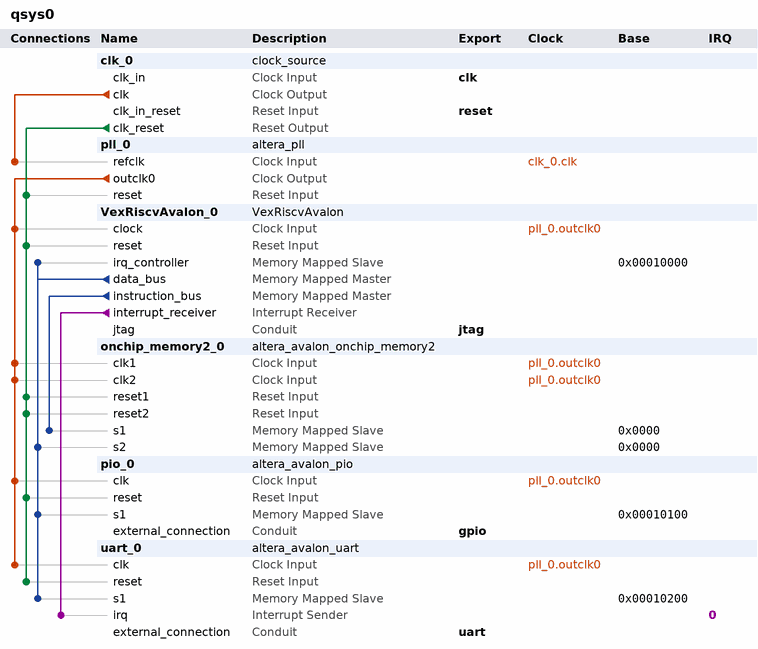
[diagram p0: system contents]
# Platform Designer (Qsys) system qsys0, Cyclone V 5CSEMA5F31C6
# Parameters at their usual value, and those the tool derives, are not listed.
package require -exact qsys 21.1
create_system qsys0
set_project_property DEVICE_FAMILY {Cyclone V}
set_project_property DEVICE 5CSEMA5F31C6

add_instance clk_0 clock_source 21.1
set_instance_parameter_value clk_0 clockFrequency 50000000

add_instance pll_0 altera_pll 21.1
set_instance_parameter_value pll_0 gui_device_speed_grade 2
set_instance_parameter_value pll_0 gui_number_of_clocks 1
set_instance_parameter_value pll_0 gui_operation_mode normal
set_instance_parameter_value pll_0 gui_output_clock_frequency0 25.0
set_instance_parameter_value pll_0 gui_pll_mode {Integer-N PLL}
set_instance_parameter_value pll_0 gui_reference_clock_frequency 50.0
set_instance_parameter_value pll_0 gui_use_locked false

add_instance VexRiscvAvalon_0 VexRiscvAvalon 1.0
set_instance_parameter_value VexRiscvAvalon_0 CORE_CONFIG 1
set_instance_parameter_value VexRiscvAvalon_0 C_EXCEPTION_VECTOR 32
set_instance_parameter_value VexRiscvAvalon_0 C_IO_BEGIN 65536
set_instance_parameter_value VexRiscvAvalon_0 C_IO_END 131071
set_instance_parameter_value VexRiscvAvalon_0 C_RESET_VECTOR 16

add_instance onchip_memory2_0 altera_avalon_onchip_memory2 21.1
set_instance_parameter_value onchip_memory2_0 dataWidth 32
set_instance_parameter_value onchip_memory2_0 dualPort true
set_instance_parameter_value onchip_memory2_0 initMemContent true
set_instance_parameter_value onchip_memory2_0 initializationFileName bootrom.mif
set_instance_parameter_value onchip_memory2_0 memorySize 32768
set_instance_parameter_value onchip_memory2_0 useNonDefaultInitFile true

add_instance pio_0 altera_avalon_pio 21.1
set_instance_parameter_value pio_0 bitModifyingOutReg true
set_instance_parameter_value pio_0 direction Bidir
set_instance_parameter_value pio_0 simDoTestBenchWiring true
set_instance_parameter_value pio_0 width 32

add_instance uart_0 altera_avalon_uart 21.1
set_instance_parameter_value uart_0 baud 115200
set_instance_parameter_value uart_0 dataBits 8
set_instance_parameter_value uart_0 fixedBaud true
set_instance_parameter_value uart_0 parity NONE
set_instance_parameter_value uart_0 stopBits 1

# connections
add_connection clk_0.clk pll_0.refclk clock
add_connection pll_0.outclk0 onchip_memory2_0.clk1 clock
add_connection pll_0.outclk0 onchip_memory2_0.clk2 clock
add_connection pll_0.outclk0 pio_0.clk clock
add_connection pll_0.outclk0 uart_0.clk clock
add_connection pll_0.outclk0 VexRiscvAvalon_0.clock clock
add_connection clk_0.clk_reset onchip_memory2_0.reset1 reset
add_connection clk_0.clk_reset onchip_memory2_0.reset2 reset
add_connection clk_0.clk_reset pio_0.reset reset
add_connection clk_0.clk_reset pll_0.reset reset
add_connection clk_0.clk_reset uart_0.reset reset
add_connection clk_0.clk_reset VexRiscvAvalon_0.reset reset
add_connection VexRiscvAvalon_0.data_bus onchip_memory2_0.s2 avalon
set_connection_parameter_value VexRiscvAvalon_0.data_bus/onchip_memory2_0.s2 baseAddress 0x0000
add_connection VexRiscvAvalon_0.data_bus pio_0.s1 avalon
set_connection_parameter_value VexRiscvAvalon_0.data_bus/pio_0.s1 baseAddress 0x00010100
add_connection VexRiscvAvalon_0.data_bus uart_0.s1 avalon
set_connection_parameter_value VexRiscvAvalon_0.data_bus/uart_0.s1 baseAddress 0x00010200
add_connection VexRiscvAvalon_0.data_bus VexRiscvAvalon_0.irq_controller avalon
set_connection_parameter_value VexRiscvAvalon_0.data_bus/VexRiscvAvalon_0.irq_controller baseAddress 0x00010000
add_connection VexRiscvAvalon_0.instruction_bus onchip_memory2_0.s1 avalon
set_connection_parameter_value VexRiscvAvalon_0.instruction_bus/onchip_memory2_0.s1 baseAddress 0x0000
add_connection VexRiscvAvalon_0.interrupt_receiver uart_0.irq interrupt
set_connection_parameter_value VexRiscvAvalon_0.interrupt_receiver/uart_0.irq irqNumber 0

# exported interfaces
add_interface clk clock sink
set_interface_property clk EXPORT_OF clk_0.clk_in
add_interface gpio conduit end
set_interface_property gpio EXPORT_OF pio_0.external_connection
add_interface jtag conduit end
set_interface_property jtag EXPORT_OF VexRiscvAvalon_0.jtag
add_interface reset reset sink
set_interface_property reset EXPORT_OF clk_0.clk_in_reset
add_interface uart conduit end
set_interface_property uart EXPORT_OF uart_0.external_connection

set_interconnect_requirement {$system} qsys_mm.clockCrossingAdapter HANDSHAKE
set_interconnect_requirement {$system} qsys_mm.enableEccProtection FALSE
set_interconnect_requirement {$system} qsys_mm.insertDefaultSlave FALSE
set_interconnect_requirement {$system} qsys_mm.maxAdditionalLatency 1

save_system qsys0.qsys
